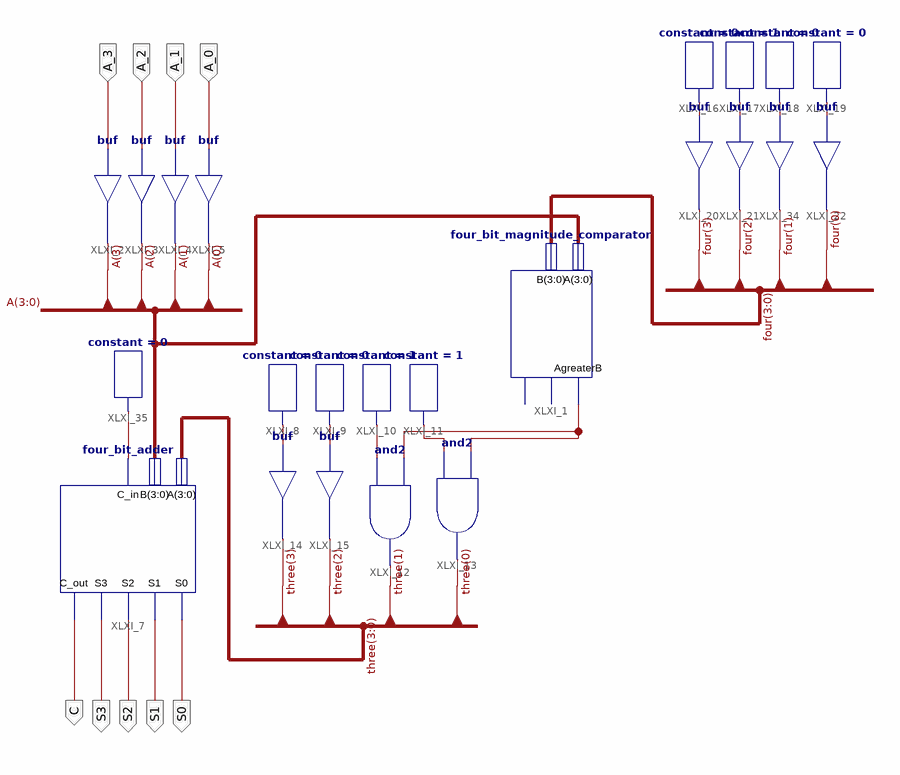
[diagram p0: schematic sheet 1]
// Xilinx ISE schematic conditional_adder.sch (artix7) as structural Verilog: 23 symbols, 9 ports
module conditional_adder (
  input  A_2,
  input  A_1,
  input  A_0,
  input  A_3,
  output S0,
  output S1,
  output S2,
  output S3,
  output C
);

  wire XLXN_27, XLXN_28, XLXN_41, XLXN_42, XLXN_51, XLXN_52, XLXN_53, XLXN_57, XLXN_73, XLXN_77;
  wire [3:0] A, four, three;

  four_bit_magnitude_comparator XLXI_1 (.A(A), .AgreaterB(XLXN_73), .B(four));  // open: AequalsB, BgreaterA
  buf XLXI_3 (A[2], A_2);
  buf XLXI_4 (A[1], A_1);
  buf XLXI_5 (A[0], A_0);
  buf XLXI_2 (A[3], A_3);
  four_bit_adder XLXI_7 (.A(three), .B(A), .C_in(XLXN_77), .C_out(C), .S0(S0), .S1(S1), .S2(S2), .S3(S3));
  constant #(.CValue("0")) XLXI_8 (.O(XLXN_41));
  constant #(.CValue("0")) XLXI_9 (.O(XLXN_42));
  constant #(.CValue("1")) XLXI_10 (.O(XLXN_27));
  constant #(.CValue("1")) XLXI_11 (.O(XLXN_28));
  and XLXI_12 (three[1], XLXN_27, XLXN_73);
  and XLXI_13 (three[0], XLXN_28, XLXN_73);
  buf XLXI_14 (three[3], XLXN_41);
  buf XLXI_15 (three[2], XLXN_42);
  constant #(.CValue("0")) XLXI_16 (.O(XLXN_51));
  constant #(.CValue("1")) XLXI_17 (.O(XLXN_52));
  constant #(.CValue("0")) XLXI_18 (.O(XLXN_57));
  constant #(.CValue("0")) XLXI_19 (.O(XLXN_53));
  buf XLXI_20 (four[3], XLXN_51);
  buf XLXI_21 (four[2], XLXN_52);
  buf XLXI_22 (four[0], XLXN_53);
  buf XLXI_34 (four[1], XLXN_57);
  constant #(.CValue("0")) XLXI_35 (.O(XLXN_77));
endmodule
